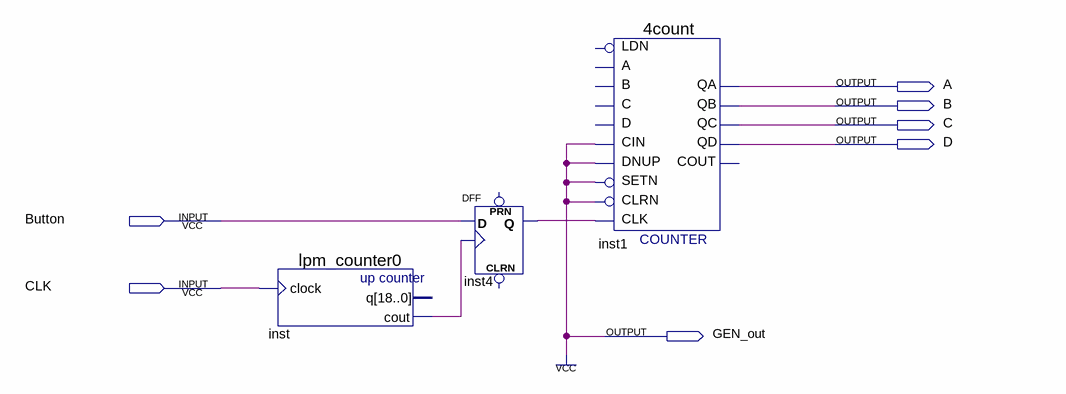
[diagram p0: schematic sheet]
// Quartus schematic lab6-1.bdf as structural Verilog: 3 symbols, 7 pins
module \lab6-1  (
  input  Button,
  input  CLK,
  output A,
  output B,
  output C,
  output D,
  output GEN_out
);

  wire inst4_q, inst_cout;

  lpm_counter0 inst (.clock(CLK), .cout(inst_cout));  // open: q
  DFF inst4 (.CLK(inst_cout), .D(Button), .Q(inst4_q));  // open: CLRN, PRN
  \4count  inst1 (
    .CIN(1'b1), .DNUP(1'b1), .CLK(inst4_q), .SETN(1'b1), .CLRN(1'b1), .QA(A), .QB(B), .QC(C), .QD(D));  // open: LDN, B, A, D, C, COUT

  assign GEN_out = 1'b1;
endmodule
